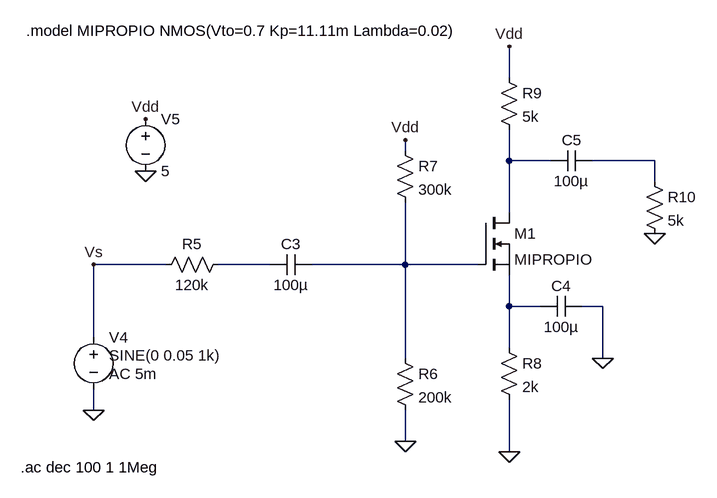
[diagram p0: schematic Draft1.asc]
Draft1.asc, the LTspice schematic file:
Version 4.1
SHEET 1 1796 680
WIRE 1504 -304 1504 -352
WIRE 1344 -192 1344 -208
WIRE 1504 -176 1504 -224
WIRE 1568 -176 1504 -176
WIRE 1728 -176 1632 -176
WIRE 1728 -144 1728 -176
WIRE 1504 -96 1504 -176
WIRE 976 -16 864 -16
WIRE 1136 -16 1056 -16
WIRE 1344 -16 1344 -112
WIRE 1344 -16 1200 -16
WIRE 1456 -16 1344 -16
WIRE 1504 48 1504 0
WIRE 1552 48 1504 48
WIRE 1648 48 1616 48
WIRE 864 96 864 -16
WIRE 1504 112 1504 48
WIRE 1344 128 1344 -16
WIRE 1648 128 1648 48
WIRE 864 208 864 176
WIRE 1344 256 1344 208
WIRE 1504 272 1504 192
FLAG 1648 128 0
FLAG 1728 -64 0
FLAG 864 208 0
FLAG 1344 256 0
FLAG 944 -160 0
FLAG 944 -240 Vdd
FLAG 1344 -208 Vdd
FLAG 1504 -352 Vdd
FLAG 1504 272 0
FLAG 864 -16 Vs
SYMBOL voltage 864 80 R0
WINDOW 3 24 44 Left 2
WINDOW 123 24 72 Left 2
WINDOW 39 0 0 Left 0
SYMATTR InstName V4
SYMATTR Value SINE(0 0.05 1k)
SYMATTR Value2 AC 5m
SYMBOL res 1072 -32 R90
WINDOW 0 0 56 VBottom 2
WINDOW 3 32 56 VTop 2
SYMATTR InstName R5
SYMATTR Value 120k
SYMBOL cap 1200 -32 R90
WINDOW 0 0 32 VBottom 2
WINDOW 3 32 32 VTop 2
SYMATTR InstName C3
SYMATTR Value 100µ
SYMBOL res 1328 112 R0
SYMATTR InstName R6
SYMATTR Value 200k
SYMBOL res 1328 -208 R0
SYMATTR InstName R7
SYMATTR Value 300k
SYMBOL nmos 1456 -96 R0
SYMATTR InstName M1
SYMATTR Value MIPROPIO
SYMBOL res 1488 96 R0
SYMATTR InstName R8
SYMATTR Value 2k
SYMBOL cap 1616 32 R90
WINDOW 0 0 32 VBottom 2
WINDOW 3 32 32 VTop 2
SYMATTR InstName C4
SYMATTR Value 100µ
SYMBOL res 1488 -320 R0
SYMATTR InstName R9
SYMATTR Value 5k
SYMBOL cap 1632 -192 R90
WINDOW 0 0 32 VBottom 2
WINDOW 3 32 32 VTop 2
SYMATTR InstName C5
SYMATTR Value 100µ
SYMBOL res 1712 -160 R0
SYMATTR InstName R10
SYMATTR Value 5k
SYMBOL voltage 944 -256 R0
WINDOW 123 0 0 Left 0
WINDOW 39 0 0 Left 0
SYMATTR InstName V5
SYMATTR Value 5
TEXT 760 -376 Left 2 !.model MIPROPIO NMOS(Vto=0.7 Kp=11.11m Lambda=0.02)
TEXT 752 296 Left 2 !.ac dec 100 1 1Meg

The netlist it stands for:
* Draft1.asc
V4 Vs 0 SINE(0 0.05 1k) AC 5m
R5 N003 Vs 120k
C3 N004 N003 100µ
R6 N004 0 200k
R7 Vdd N004 300k
M1 N001 N004 N005 N005 MIPROPIO
R8 N005 0 2k
C4 0 N005 100µ
R9 Vdd N001 5k
C5 N002 N001 100µ
R10 N002 0 5k
V5 Vdd 0 5
.model NMOS NMOS
.model PMOS PMOS
.lib standard.mos
.model MIPROPIO NMOS(Vto=0.7 Kp=11.11m Lambda=0.02)
.ac dec 100 1 1Meg
.backanno
.end